# EAGLE schematic Power Supply Schematic (EAGLE 8.6.2)
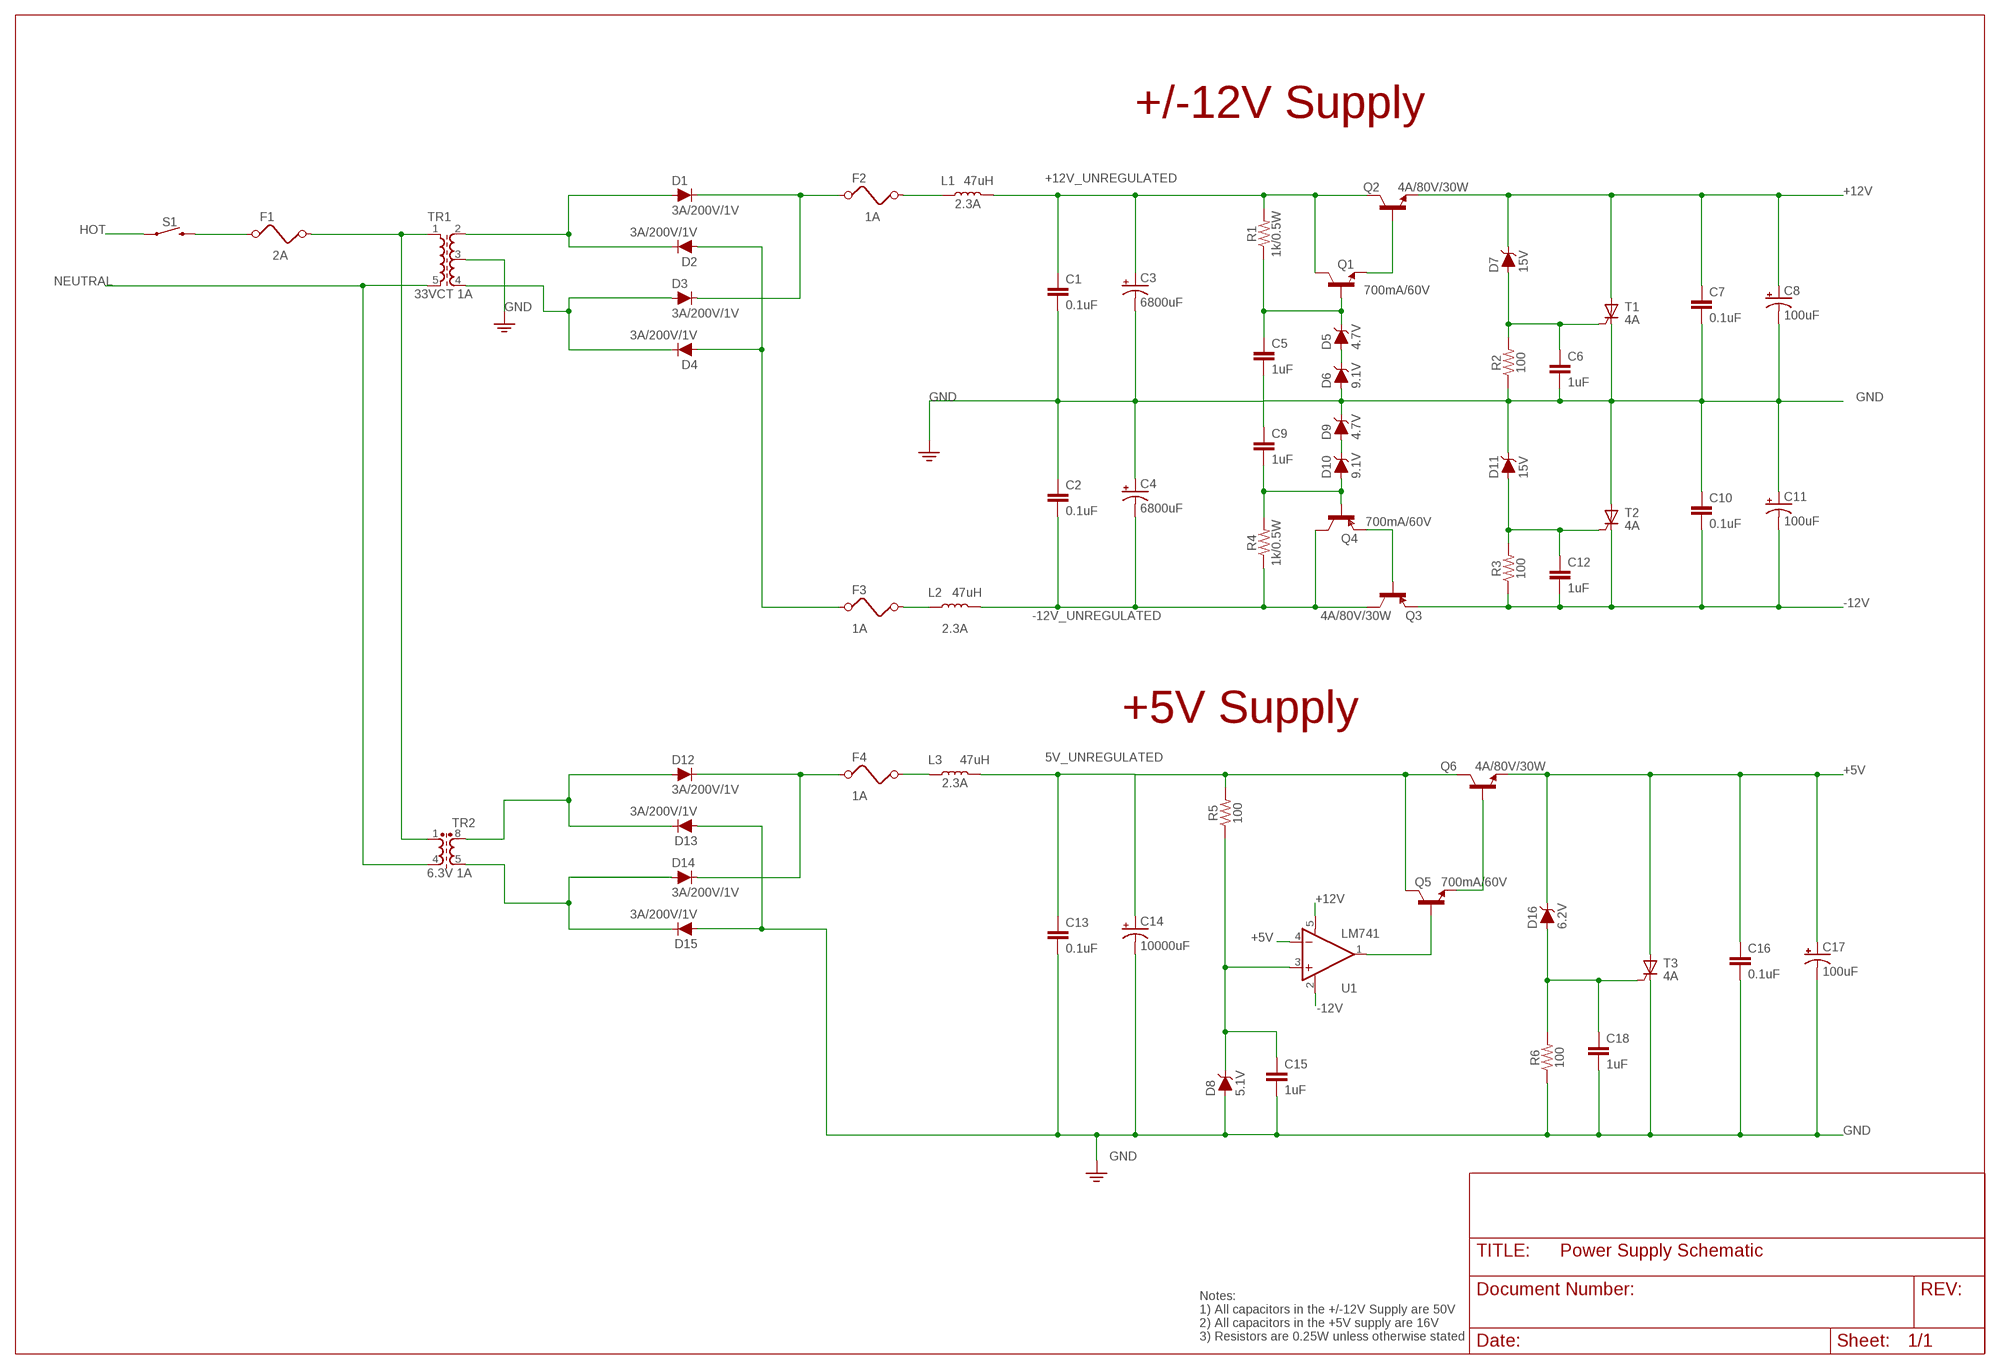
[diagram p0: schematic, sheet 1]

## Parts
C1  0.1uF  0.1UF-0402-16V-10%  [0402]
C2  0.1uF  0.1UF-0402-16V-10%  [0402]
C3  6800uF  100UF-POLAR-10X10.5-63V-20%  [NIC_10X10.5_CAP]
C4  6800uF  100UF-POLAR-10X10.5-63V-20%  [NIC_10X10.5_CAP]
C5  1uF  0.1UF-0402-16V-10%  [0402]
C6  1uF  0.1UF-0402-16V-10%  [0402]
C7  0.1uF  0.1UF-0402-16V-10%  [0402]
C8  100uF  100UF-POLAR-10X10.5-63V-20%  [NIC_10X10.5_CAP]
C9  1uF  0.1UF-0402-16V-10%  [0402]
C10  0.1uF  0.1UF-0402-16V-10%  [0402]
C11  100uF  100UF-POLAR-10X10.5-63V-20%  [NIC_10X10.5_CAP]
C12  1uF  0.1UF-0402-16V-10%  [0402]
C13  0.1uF  0.1UF-0402-16V-10%  [0402]
C14  10000uF  100UF-POLAR-10X10.5-63V-20%  [NIC_10X10.5_CAP]
C15  1uF  0.1UF-0402-16V-10%  [0402]
C16  0.1uF  0.1UF-0402-16V-10%  [0402]
C17  100uF  100UF-POLAR-10X10.5-63V-20%  [NIC_10X10.5_CAP]
C18  1uF  0.1UF-0402-16V-10%  [0402]
D1  3A/200V/1V  DIODE-1N4148  [DIODE-1N4148]
D2  3A/200V/1V  DIODE-1N4148  [DIODE-1N4148]
D3  3A/200V/1V  DIODE-1N4148  [DIODE-1N4148]
D4  3A/200V/1V  DIODE-1N4148  [DIODE-1N4148]
D5  4.7V  DIODE-ZENER-BZT52C3V6S  [SOD-323]
D6  9.1V  DIODE-ZENER-BZT52C3V6S  [SOD-323]
D7  15V  DIODE-ZENER-BZT52C3V6S  [SOD-323]
D8  5.1V  DIODE-ZENER-BZT52C3V6S  [SOD-323]
D9  4.7V  DIODE-ZENER-BZT52C3V6S  [SOD-323]
D10  9.1V  DIODE-ZENER-BZT52C3V6S  [SOD-323]
D11  15V  DIODE-ZENER-BZT52C3V6S  [SOD-323]
D12  3A/200V/1V  DIODE-1N4148  [DIODE-1N4148]
D13  3A/200V/1V  DIODE-1N4148  [DIODE-1N4148]
D14  3A/200V/1V  DIODE-1N4148  [DIODE-1N4148]
D15  3A/200V/1V  DIODE-1N4148  [DIODE-1N4148]
D16  6.2V  DIODE-ZENER-BZT52C3V6S  [SOD-323]
F1  FUSE  [FUSE]
F2  FUSE  [FUSE]
F3  FUSE  [FUSE]
F4  FUSE  [FUSE]
L1  47uH  INDUCTOR-0402-3.9NH  [0402]
L2  47uH  INDUCTOR-0402-3.9NH  [0402]
L3  47uH  INDUCTOR-0402-3.9NH  [0402]
Q1  700mA/60V  TRANS_NPN-2N3904  [TO-92]
Q2  4A/80V/30W  TRANS_NPN-2N3904  [TO-92]
Q3  4A/80V/30W  TRANS_PNP-PMBT3906|MMBT3906L  [SOT23-3]
Q4  700mA/60V  TRANS_PNP-PMBT3906|MMBT3906L  [SOT23-3]
Q5  700mA/60V  TRANS_NPN-2N3904  [TO-92]
Q6  4A/80V/30W  TRANS_NPN-2N3904  [TO-92]
R1  1k/0.5W  0.11OHM-2010-1/2W-1%  [2010]
R2  100  0.11OHM-2010-1/2W-1%  [2010]
R3  100  0.11OHM-2010-1/2W-1%  [2010]
R4  1k/0.5W  0.11OHM-2010-1/2W-1%  [2010]
R5  100  0.11OHM-2010-1/2W-1%  [2010]
R6  100  0.11OHM-2010-1/2W-1%  [2010]
S1  MOMENTARY-SWITCH-SPST-PTH-6.0MM  [TACTILE_SWITCH_PTH_6.0MM]
T1  BRX44  [SOT54]
T2  BRX44  [SOT54]
T3  BRX44  [SOT54]
TR1  MS40A  [MS40]
TR2  SMR6-2W  [SM-R6]
U1  LM741  MCP6291T-E/OT  [SOT23-5]

## Nets
5V_UNREGULATED: C13.1 C14.+ L3.2 Q5.3(C) Q6.3(C) R5.2
+5V: C16.1 C17.+ D16.C Q6.1(E) T3.A U1.4(-IN)
+12V: C7.1 C8.+ D7.C Q2.1(E) T1.A U1.5(V+)
+12V_UNREGULATED: C1.1 C3.+ L1.2 Q1.3(C) Q2.3(C) R1.2
-12V: C10.2 C11.- C12.2 Q3.2(E) R3.1 T2.C U1.2(V-)
-12V_UNREGULATED: C2.2 C4.- L2.2 Q3.3(C) Q4.3(C) R4.1
GND: C1.2 C2.1 C3.- C4.+ C5.2 C6.2 C7.2 C8.- C9.1 C10.1 C11.+ C13.2 C14.- C15.2 C16.2 C17.- C18.2 D6.A D8.A D9.C D11.C D13.A D15.A R2.1 R6.1 T1.C T2.A T3.C TR1.3 ; supply symbol labelled GND2
HOT: S1.1
N$1: F1.1 S1.3
N$2: F1.2 TR1.1 TR2.1
N$4: D1.A D2.C TR1.2
N$5: D3.A D4.C TR1.4
N$6: F2.2 L1.1
N$7: D1.C D3.C F2.1
N$8: D2.A D4.A F3.1
N$9: F3.2 L2.1
N$10: D12.A D13.C TR2.8
N$12: C5.1 D5.C Q1.2(B) R1.1
N$13: Q1.1(E) Q2.2(B)
N$14: D5.A D6.C
N$15: Q3.1(B) Q4.2(E)
N$16: C6.1 D7.A R2.2 T1.G
N$17: C12.1 D11.A R3.2 T2.G
N$18: D9.A D10.C
N$19: C9.2 D10.A Q4.1(B) R4.2
N$20: D14.A D15.C TR2.5
N$22: D12.C D14.C F4.1
N$24: F4.2 L3.1
N$25: C18.1 D16.A R6.2 T3.G
N$27: Q5.1(E) Q6.2(B)
N$28: Q5.2(B) U1.1(OUT)
N$29: C15.1 D8.C R5.1 U1.3(+IN)
NEUTRAL: TR1.5 TR2.4

## Notes on the sheet
- +/-12V Supply
- 2.3A
- TR1 | 1A
- 2A
- 33VCT 1A
- 4A
- 4A
- 1A | 2.3A
- +5V Supply
- 2.3A
- 1A
- 6.3V 1A
- 4A
- Notes:
  1) All capacitors in the +/-12V Supply are 50V
  2) All capacitors in the +5V supply are 16V
  3) Resistors are 0.25W unless otherwise stated

## Library data of the parts
C1 C2 C7 C10 C13 C16 = SparkFun-Capacitors:0.1UF: 0.1µF ceramic capacitors A capacitor is a passive two-terminal electrical component used to store electrical energy temporarily in an electric field.; PROD_ID: CAP-12416
C3 C4 C14 = SparkFun-Capacitors:100UF-POLAR: 100µF polarized capacitors A capacitor is a passive two-terminal electrical component used to store electrical energy temporarily in an electric field.; PROD_ID: CAP-08362; VALUE: 100uF
C5 C6 C9 C12 C15 C18 = SparkFun-Capacitors:0.1UF: 0.1µF ceramic capacitors A capacitor is a passive two-terminal electrical component used to store electrical energy temporarily in an electric field.; PROD_ID: CAP-12416; VALUE: 0.1uF
C8 C11 C17 = SparkFun-Capacitors:100UF-POLAR: 100µF polarized capacitors A capacitor is a passive two-terminal electrical component used to store electrical energy temporarily in an electric field.; PROD_ID: CAP-08362
D1-D4 D12-D15 = SparkFun-DiscreteSemi:DIODE: Diode These are standard reverse protection diodes and small signal diodes. SparkFun Products: SparkFun SparkPunk Sound Kit <https://www.sparkfun.com/products/11177> SparkFun ESP8266 Thing <https://www.sparkfun.com/products/13231>; PROD_ID: DIO-08378; VALUE: 200mA/100V/1V
D5-D11 D16 = SparkFun-DiscreteSemi:DIODE-ZENER: Zener Diode A Zener diode allows current to flow from its anode to its cathode like a normal semiconductor diode, but it also permits current to flow in the reverse direction when its "Zener voltage" is reached. - WIkipedia; PROD_ID: DIO-08199; VALUE: 3.6V
F1-F4 = special:FUSE: FUSE 5 x 20 mm
L1-L3 = SparkFun-Coils:INDUCTOR: Inductors Resist changes in electrical current. Basically a coil of wire. SparkFun Products: SparkFun Load Cell Amplifier - HX711 <https://www.sparkfun.com/products/13879> IOIO-OTG - V2.2 <https://www.sparkfun.com/products/13613>; PROD_ID: NDUC-13457; VALUE: 3.9NH
Q1 Q2 Q5 Q6 = SparkFun-DiscreteSemi:TRANS_NPN: NPN transistor Current controlled devices typically used to amplify current or used as a switch. BC547 - COM-08928 <http://www.sparkfun.com/products/8928> (TO-92 45V 100mA) (1.Collector 2.Base 3.Emitter) 2N3904 - COM-00521 <http://www.sparkfun.com/products/521> (TO-92 40V 200mA) (1.Emitter 2.Base 3.Collector) P2N2222A - COM-12852 <http://www.sparkfun.com/products/12852> (TO-92 40V 600mA) (1.Collector 2.Base 3.Emitter); PROD_ID: TRANS-08447; VALUE: 200mA/40V
Q3 Q4 = SparkFun-DiscreteSemi:TRANS_PNP: PNP transistor Current controlled devices typically used to amplify current or used as a switch. SparkFun Products: SparkFun Serial Enabled 16x2 LCD - Red on Black <https://www.sparkfun.com/products/9068> SparkFun Logomatic <https://www.sparkfun.com/products/12772>; PROD_ID: TRANS-08052; VALUE: 200mA/40V
R1-R6 = SparkFun-Resistors:0.11OHM: 0.11Ω resistor A resistor is a passive two-terminal electrical component that implements electrical resistance as a circuit element. Resistors act to reduce current flow, and, at the same time, act to lower voltage levels within circuits. - Wikipedia; PROD_ID: RES-08354; VALUE: 0.11
S1 = SparkFun-Switches:MOMENTARY-SWITCH-SPST: Momentary Switch (Pushbutton) - SPST Normally-open (NO) SPST momentary switches (buttons, pushbuttons). Variants PTH-12MM - 12mm square, through-hole Momentary Pushbutton Switch - 12mm Square <https://www.sparkfun.com/products/9190> (COM-09190) PTH-6.0MM, PTH-6.0MM-KIT - 6.0mm square, through-hole Mini Pushbutton Switch <https://www.sparkfun.com/products/97> (COM-00097) KIT package intended for soldering kit's - only one side of pads' copper is exposed. PTH-RIGHT-ANGLE-KIT - Right-angle, through-hole Right Angle Tactile Button <https://www.sparkfun.com/products/10791> - Used on SparkFun BigTime Watch Kit <https://www.sparkfun.com/products/11734> SMD-12MM - 12mm square, surface-mount Tactile Button - SMD (12mm) <https://www.sparkfun.com/products/12993> (COM-12993) Used on SparkFun PicoBoard <https://www.sparkfun.com/products/11888> SMD-4.5MM - 4.5mm Square Trackball Switch Used on SparkFun Blackberry Trackballer Breakout <https://www.sparkfun.com/products/13169> SMD-4.6MMX2.8MM - 4.60mm x 2.80mm, surface mount Used on SparkFun SAMD21 Mini Breakout <https://www.sparkfun.com/products/13664> SMD-5.2MM, SMD-5.2-REDUNDANT - 5.2mm square, surface-mount Mini Pushbutton Switch - SMD <https://www.sparkfun.com/products/8720> (COM-08720) Used on Arduino Pro Mini <https://www.sparkfun.com/products/11114> REDUNDANT package connects both switch circuits together SMD-6.0X3.5MM - 6.0 x 3.5mm, surface mount Momentary Reset Switch SMD <https://www.sparkfun.com/products/8229> (COM-08229) SMD-6.2MM-TALL - 6.2mm square, surface mount Tactile Button - SMD (6mm) <https://www.sparkfun.com/products/12992> Used on SparkFun Digital Sandbox <https://www.sparkfun.com/products/12651> SMD-RIGHT-ANGLE - Right-angle, surface mount Used on SparkFun Block for Intel® Edison - Arduino <https://www.sparkfun.com/products/13036>; PROD_ID: SWCH-08441; SF_SKU: COM-00097
T1-T3 = triac:BRX4*: THYRISTOR
TR1 = inductor-neosid:MS40: TRANSFORMER SMD transformer acc. to customer specification; OC_FARNELL: unknown; OC_NEWARK: unknown
TR2 = inductor-neosid:SMR6-2W: TRANSFORMER SMD toroidal-core transformer with 2 windings; OC_FARNELL: unknown; OC_NEWARK: unknown
U1 = SparkFun-Retired:MCP6291: Rail to rail OpAmp with 10MHz GBP Prototype: IC-11991; PROD_ID: IC-11991; VALUE: MCP6291T